# EasyEDA schematic SCH_battery monitoring system_updated_2024-02-15 (2).json
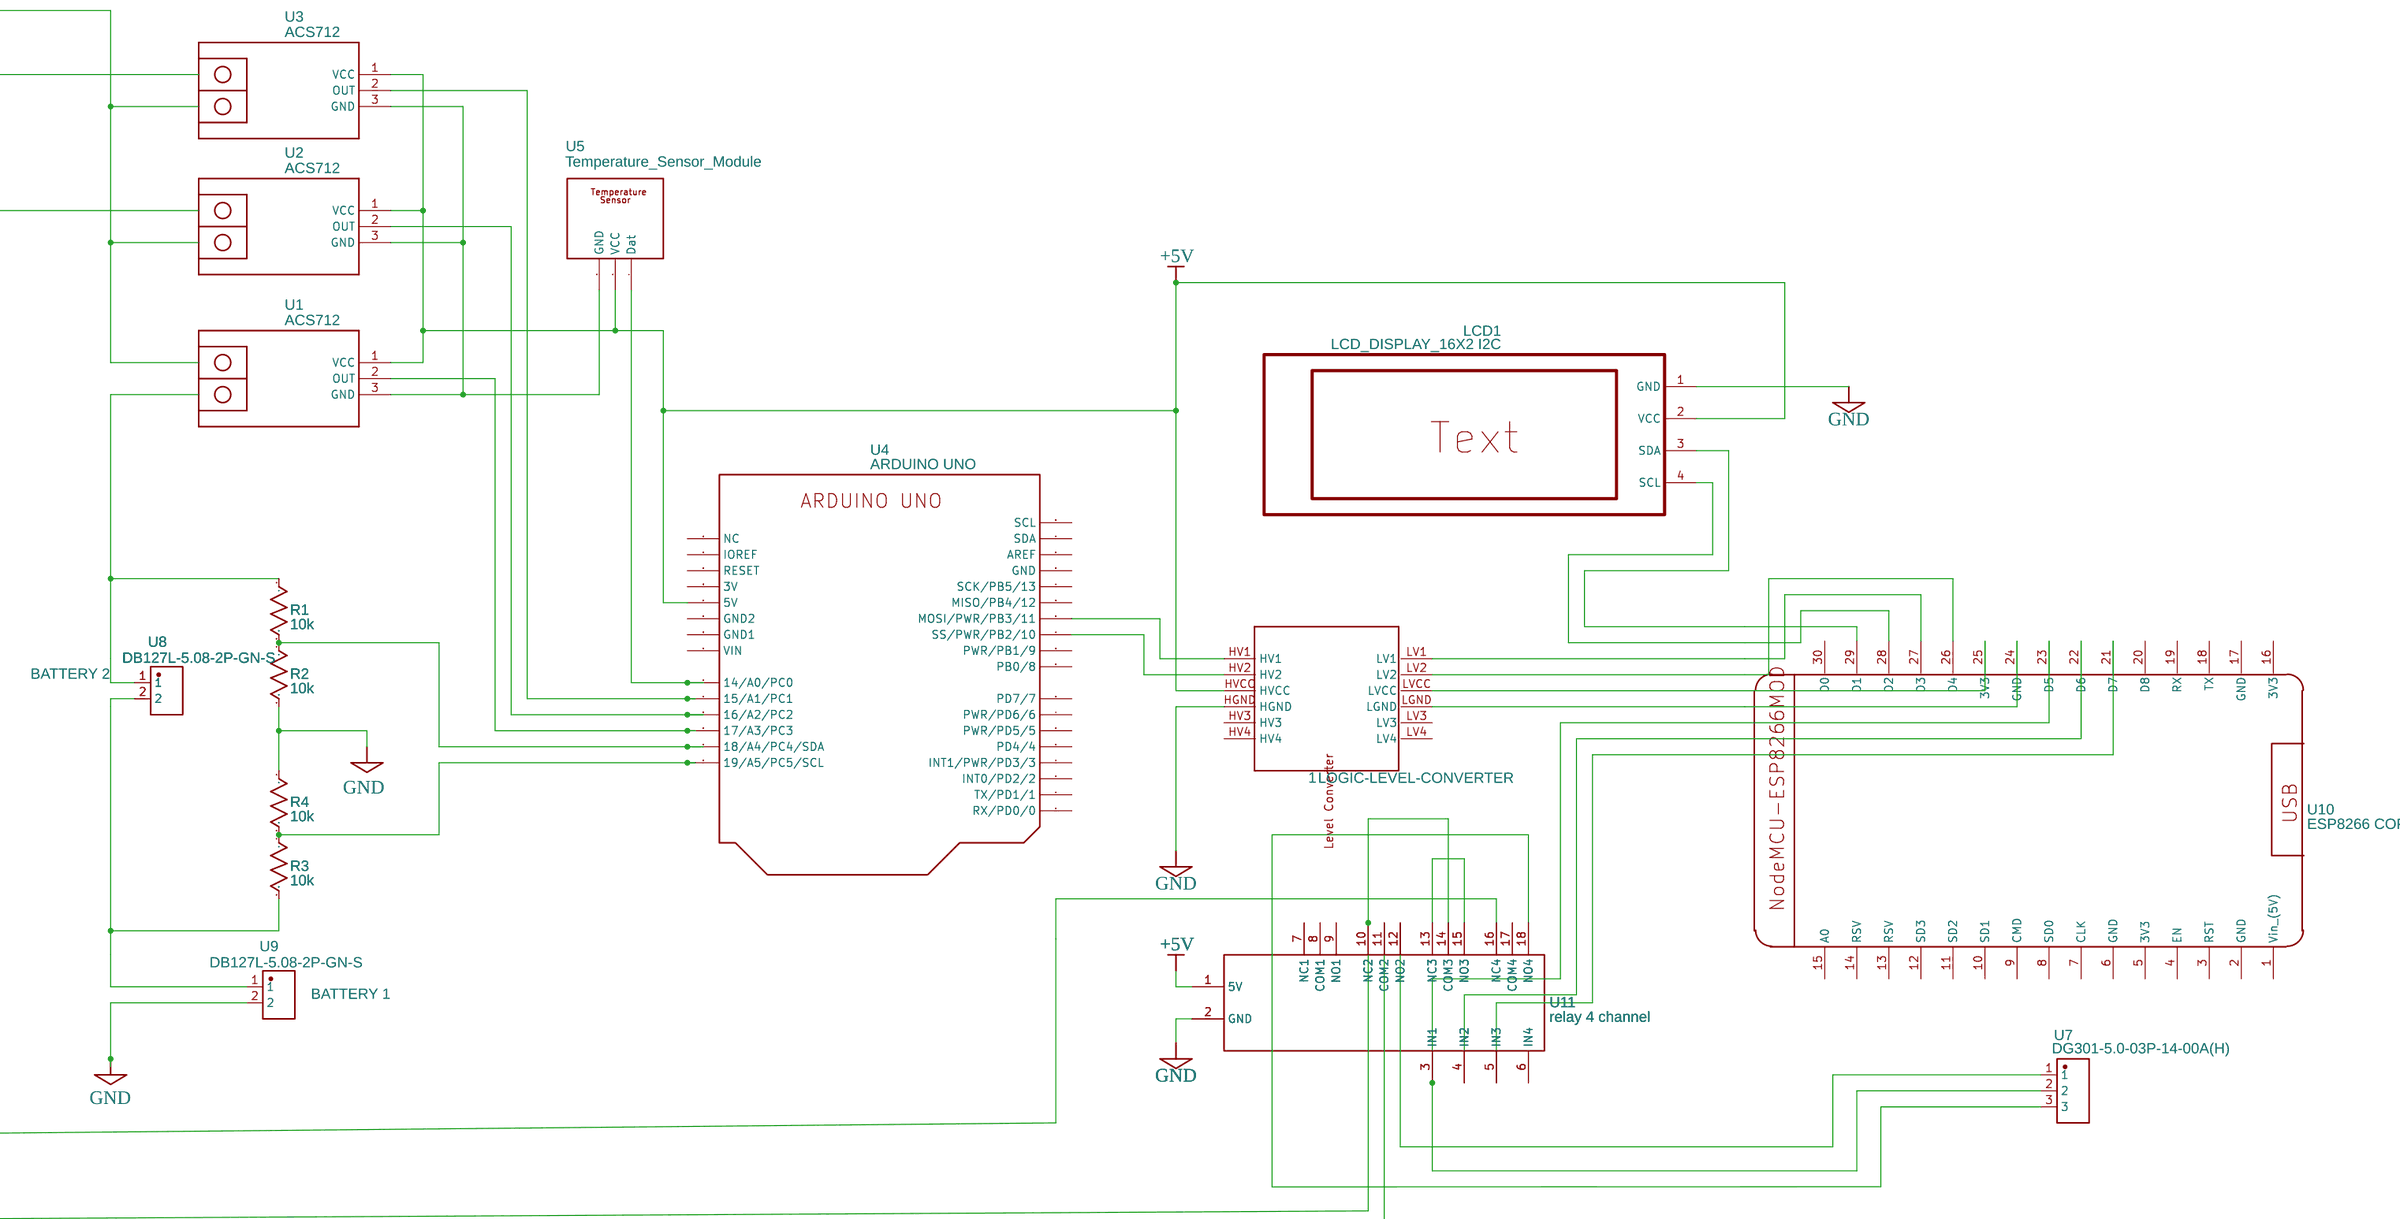
[diagram p0: schematic sheet]

## Parts
1  LOGIC-LEVEL-CONVERTER  [LOGIC-LEVEL-CONVERTER]
LCD1  LCD_DISPLAY_16X2 I2C  [LCD_2004_4-8BIT_IF LCD_2004_4-8BIT_IF V4 I2C]
R1  10k  [R0603]
R2  10k  [R0603]
R3  10k  [R0603]
R4  10k  [R0603]
U1  ACS712  [CURRENT-SENSOR-ACS712]
U2  ACS712  [CURRENT-SENSOR-ACS712]
U3  ACS712  [CURRENT-SENSOR-ACS712]
U4  ARDUINO UNO  [UNO_R3;WO ARDUINO UNO]
U5  Temperature_Sensor_Module  [DS18B20_TEMPERATURE_SENSOR_MODULE_KIT]
U7  DG301-5.0-03P-14-00A(H)  [CONN-TH_DEGSON_DG301-5.0-03P]
U8  DB127L-5.08-2P-GN-S  [CONN-TH_2P-P5.08_DB127L-5.08-2P-GN-S]
U9  DB127L-5.08-2P-GN-S  [CONN-TH_2P-P5.08_DB127L-5.08-2P-GN-S]
U10  ESP8266 COPY  [NODEMCU-ESP8266MOD]
U11  relay 4 channel  [RELAY 4 CHANNEL LAYOUT]

## Library data of the parts
1 = LOGIC-LEVEL-CONVERTER: Contributor: LukasH97
LCD1 = LCD_DISPLAY_16X2 I2C: 15: A; sourceId: yDLFXRL3l; Contributor: sietsestiksma
R1-R4 = R_0603_US: Contributor: LCEDA_Lib
U1-U3 = CURRENT-SENSOR-ACS712: Isolated Bipolar Current Sensors based on ACS712 chip
U4 = ARDUINO UNO: Contributor: sophiachen04; sourceId: frlCUcuMG
U5 = DS18B20_Temperature_Sensor_Module: Contributor: coveyjorjet13
U7 = DG301-5.0-03P-14-00A(H): Contributor: lcsc; Supplier: LCSC; Supplier Part: C5128811; Manufacturer: DEGSON（高正/高松）; JLCPCB Part Class: Extended Part
U8 U9 = DB127L-5.08-2P-GN-S: Contributor: lcsc; Supplier: LCSC; Supplier Part: C5205014; Manufacturer: DORABO(地博电气)
U10 = ESP8266 COPY: Supplier: LCSC; Supplier Part: C111436; Manufacturer: Ai-Thinker; Manufacturer Part: NodeMCU-8266Lua; Contributor: Fabio Sv; link: https://lcsc.com/product-detail/Modules_NodeMCU-32S-Lua_C111436.html
U11 = relay 4 channel: Contributor: iammicrop

## Nets
+5V: 1.HVCC LCD1.2(VCC) U1.1(VCC) U2.1(VCC) U3.1(VCC) U4.28(5V) U5.2(VCC) U11.1(5V)
GND: 1.HGND LCD1.1(GND) R2.2 R4.1 U9.2 U11.2(GND)
Net-(1-HV1): 1.HV1 U4.12(MOSI/PWR/PB3/11)
Net-(1-HV2): 1.HV2 U4.11(SS/PWR/PB2/10)
Net-(1-LGND): 1.LGND U10.24(GND)
Net-(1-LV1): 1.LV1 U10.27(D3)
Net-(1-LV2): 1.LV2 U10.26(D4)
Net-(1-LVCC): 1.LVCC U10.25(3V3)
Net-(LCD1-3): LCD1.3(SDA) U10.29(D1)
Net-(LCD1-4): LCD1.4(SCL) U10.28(D2)
Net-(R1-1): R1.1 U8.1
Net-(R1-2): R1.2 R2.1 U4.20(18/A4/PC4/SDA)
Net-(R3-1): R3.1 R4.2 U4.19(19/A5/PC5/SCL)
Net-(R3-2): R3.2 U8.2 U9.1
Net-(U1-2): U1.2(OUT) U4.21(17/A3/PC3)
Net-(U1-3): U1.3(GND) U2.3(GND) U3.3(GND) U5.3(GND)
Net-(U2-2): U2.2(OUT) U4.22(16/A2/PC2)
Net-(U3-2): U3.2(OUT) U4.23(15/A1/PC1)
Net-(U4-24): U4.24(14/A0/PC0) U5.1(Dat)
Net-(U7-1): U7.1 U11.12(NO2)
Net-(U7-2): U7.2 U10.23(D5) U11.3(IN1)
Net-(U7-3): U7.3 U11.18(NO4)
Net-(U10-21): U10.21(D7) U11.5(IN3)
Net-(U10-22): U10.22(D6) U11.4(IN2)
Net-(U11-10): U11.10(NC2) U11.14(COM3)
Net-(U11-13): U11.13(NC3) U11.15(NO3)

Not connected (* = marked no-connect by the designer): 1 HV3 HV4 LV3 LV4; U4 1(RX/PD0/0) 2(TX/PD1/1) 3(INT0/PD2/2) 4(INT1/PWR/PD3/3) 5(PD4/4) 6(PWR/PD5/5) 7(PWR/PD6/6) 8(PD7/7) 9(PB0/8) 10(PWR/PB1/9) 13(MISO/PB4/12) 14(SCK/PB5/13) 15(GND) 16(AREF) 17(SDA) 18(SCL) 25(VIN) 26(GND1) 27(GND2) 29(3V) 30(RESET) 31(IOREF) 32(NC); U10 1(Vin (5V)) 2(GND) 3(RST) 4(EN) 5(3V3) 6(GND) 7(CLK) 8(SD0) 9(CMD) 10(SD1) 11(SD2) 12(SD3) 13(RSV) 14(RSV) 15(A0) 16(3V3) 17(GND) 18(TX) 19(RX) 20(D8) 30(D0); U11 6(IN4) 7(NC1) 8(COM1) 9(NO1) 11(COM2) 16(NC4) 17(COM4)

## Notes on the sheet
- BATTERY 2
- BATTERY 1
